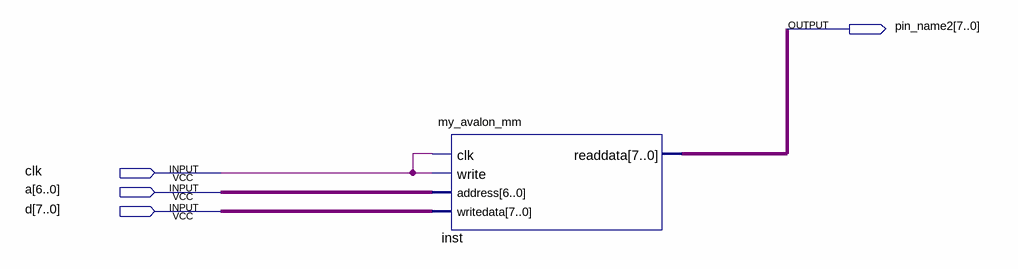
[diagram p0: schematic sheet]
// Quartus schematic check_synt.bdf as structural Verilog: 1 symbols, 4 pins
module check_synt (
  input  clk,
  input  [6:0] a,
  input  [7:0] d,
  output [7:0] pin_name2
);

  my_avalon_mm inst (.clk(clk), .write(clk), .address(a), .writedata(d), .readdata(pin_name2));
endmodule
